# EAGLE design switch-break (EAGLE 6.5.0)
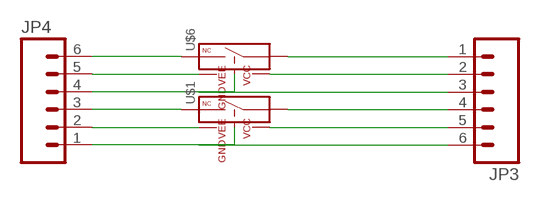
[diagram p0: schematic, sheet 1]

## Parts
JP3  M06LONGPADS  [1X06_LONGPADS]
JP4  M06LONGPADS  [1X06_LONGPADS]
U$1  DG467  [TSSOP-6]
U$6  DG467  [TSSOP-6]

## Nets
N$1: JP3.3 U$6.P$4(GND)
N$2: JP4.4 U$6.P$3(CTL)
N$3: JP3.2 U$6.P$5(VCC)
N$4: JP3.4 U$1.P$6(COM)
N$5: JP3.1 U$6.P$6(COM)
N$6: JP4.5 U$6.P$2(VEE)
N$7: JP4.3 U$1.P$1(IN)
N$8: JP3.5 U$1.P$5(VCC)
N$9: JP4.2 U$1.P$2(VEE)
N$10: JP3.6 U$1.P$4(GND)
N$11: JP4.1 U$1.P$3(CTL)
N$12: JP4.6 U$6.P$1(IN)

## Library data of the parts
JP3 JP4 = SparkFun-Connectors:M06: Header 6 Standard 6-pin 0.1" header. Use with straight break away headers (SKU : PRT-00116), right angle break away headers (PRT-00553), swiss pins (PRT-00743), machine pins (PRT-00117), and female headers (PRT-00115). Molex polarized connector foot print use with SKU : PRT-08094 with associated crimp pins and housings. NOTES ON THE VARIANTS LOCK and LOCK_LONGPADS... This footprint was designed to help hold the alignment of a through-hole component (i.e. 6-pin header) while soldering it into place. You may notice that each hole has been shifted either up or down by 0.005 of an inch from it's more standard position (which is a perfectly straight line). This slight alteration caused the pins (the squares in the middle) to touch the edges of the holes. Because they are alternating, it causes a "brace" to hold the component in place. 0.005 has proven to be the perfect amount of "off-center" position when using our standard breakaway headers. Although looks a little odd when you look at the bare footprint, once you have a header in there, the alteration is very hard to notice. Also,if you push a header all the way into place, it is covered up entirely on the bottom side. This idea of altering the position of holes to aid alignment will be further integrated into the Sparkfun Library for other footprints. It can help hold any component with 3 or more connection pins.
U$1 U$6 = butter:DG467

## Board
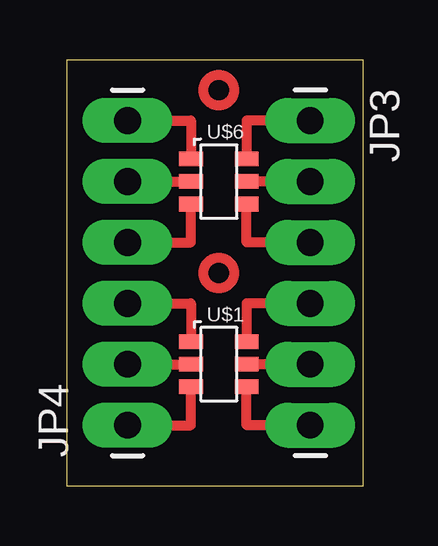
[diagram p1: board, top side]

Size 12.37 x 17.77 mm. Coordinates in mm from the lower left corner, seen from the top.
Outline: 0,0 12.37,0 12.37,17.77 0,17.77 0,0
Copper layers (1*16): Top 0.035mm / dielectric 1.5mm / Bottom 0.035mm
Design rules "default": minimum track width 10mil, minimum drill 24mil, track to track 8mil, track to pad 8mil, pad to pad 8mil, via to via 8mil, smd to smd 8mil, copper to edge 40mil, drill to drill 8mil, minimum pad ring 10mil, minimum via ring 8mil, stop-mask expansion 4mil, vias tented up to drill 0mil, thermal gap 10mil

### Footprints (pad centres in the part's own frame; a part is rotated, then mirrored left to right if it is on the bottom)
1X06_LONGPADS = drill 1.118 pad 1.88 long: 1 0,0; 2 2.54,0; 3 5.08,0; 4 7.62,0; 5 10.16,0; 6 12.7,0
TSSOP-6 = smd 0.991 x 0.61: P$1 -1.161,0.94; P$2 -1.161,0; P$3 -1.161,-0.94; P$4 1.161,-0.94; P$5 1.161,0; P$6 1.161,0.94

### Placement (x,y rotation side)
JP3  10.16,15.24 270 top
JP4  2.54,2.54 90 top
U$1  6.35,5.08 0 top
U$6  6.35,12.7 0 top

### Tracks (layer width: path | path; a pad name or v marks a point on that pad's centre or on a via)
N$1
  Top 0.406: U$6.P$4 7.51,10.16 JP3.3
N$2
  Top 0.406: U$6.P$3 5.19,10.16 JP4.4
N$3
  Top 0.406: JP3.2 U$6.P$5
N$4
  Top 0.406: U$1.P$6 7.51,7.62 JP3.4
N$5
  Top 0.406: U$6.P$6 7.51,15.24 JP3.1
N$6
  Top 0.406: JP4.5 U$6.P$2
N$7
  Top 0.406: U$1.P$1 5.19,7.62 JP4.3
N$8
  Top 0.406: JP3.5 U$1.P$5
N$9
  Top 0.406: JP4.2 U$1.P$2
N$10
  Top 0.406: U$1.P$4 7.51,2.54 JP3.6
N$11
  Top 0.406: U$1.P$3 5.19,2.54 JP4.1
N$12
  Top 0.406: U$6.P$1 5.19,15.24 JP4.6
(copper drawn outside any net)
  shapes: Top circle x2